# EAGLE schematic DME_Board_1 (EAGLE 7.2.0)
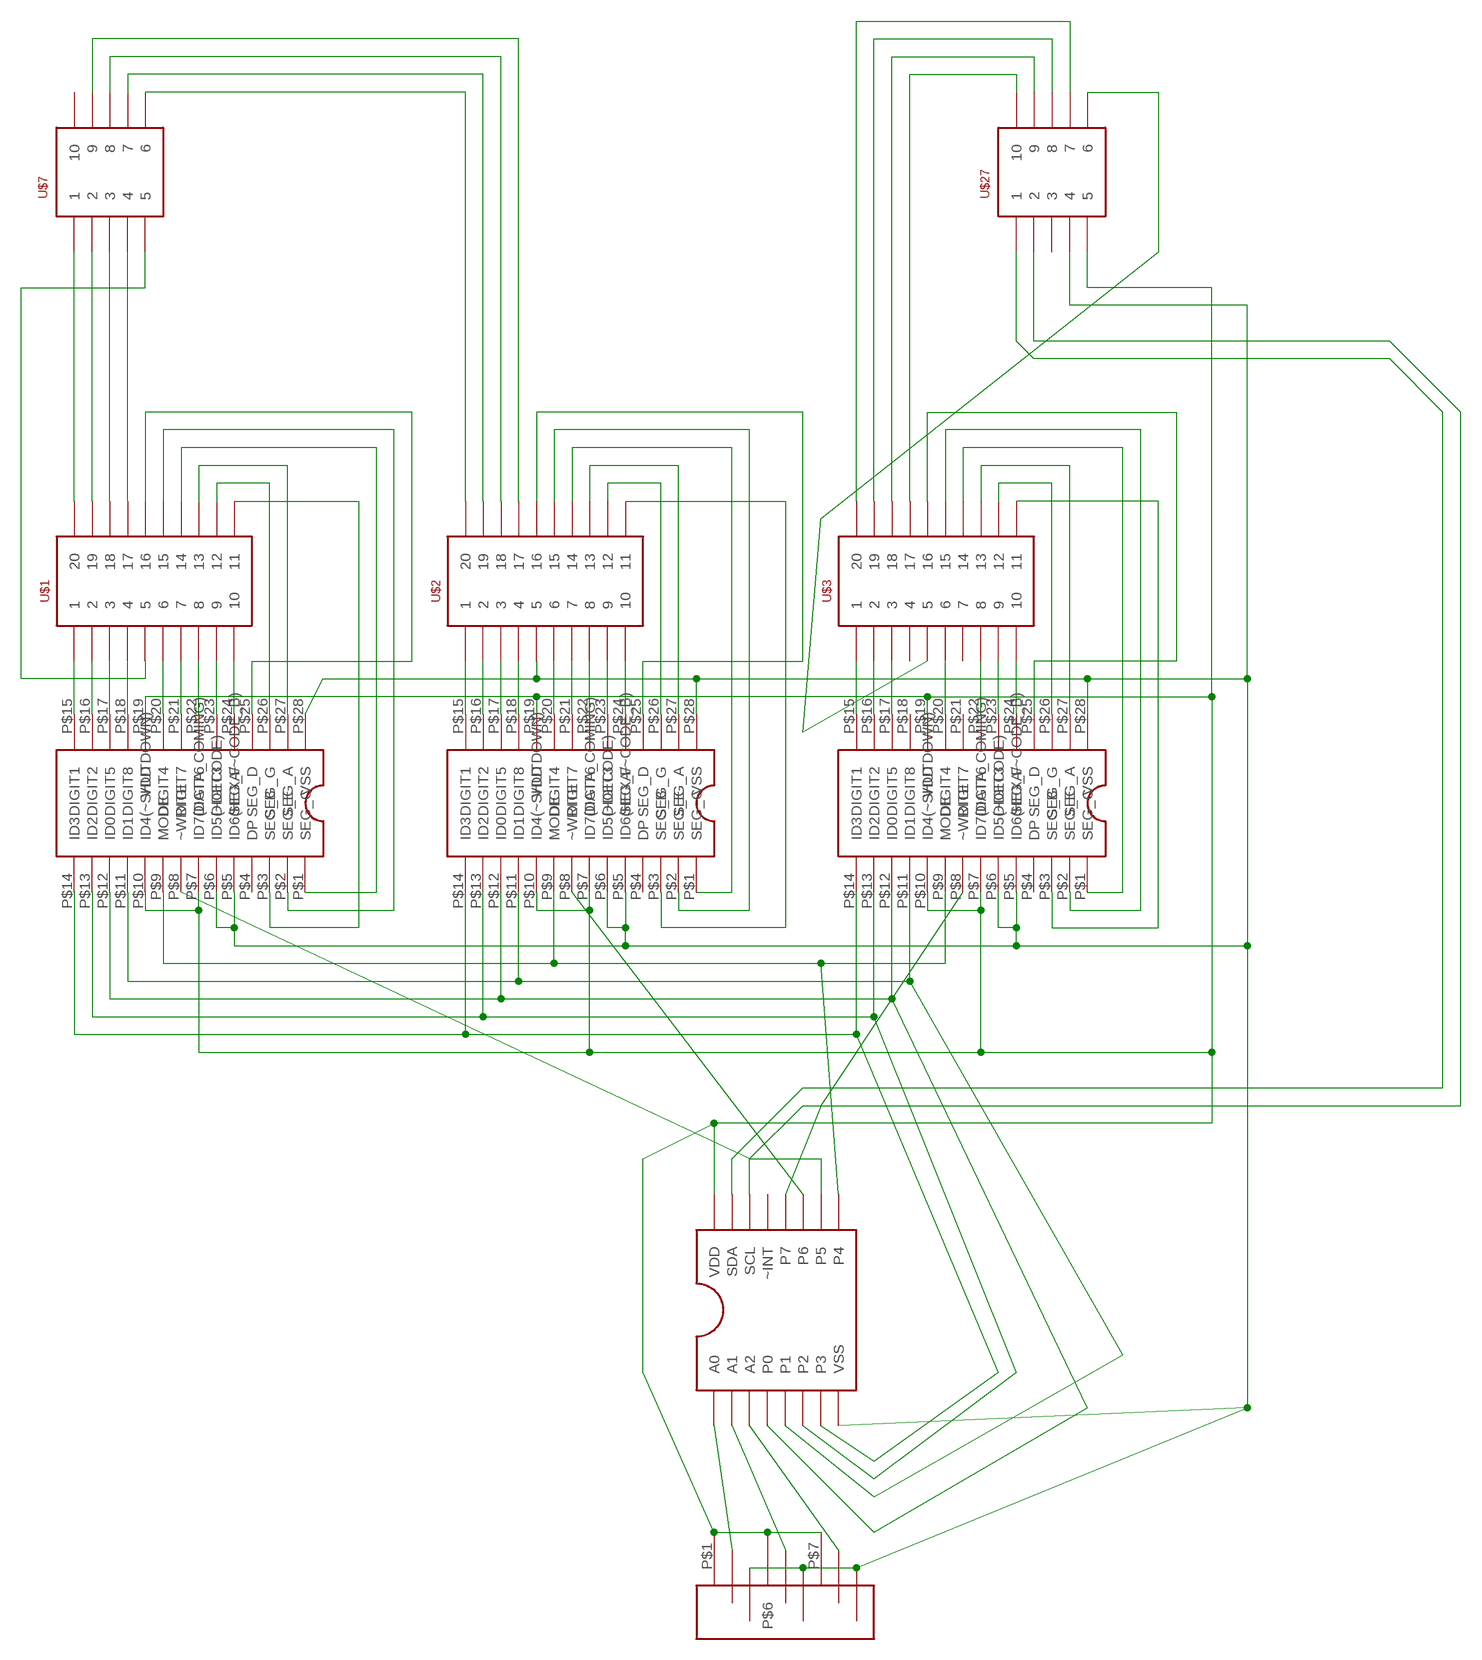
[diagram p0: schematic, sheet 1]

## Parts
U$1  LISTA_2X10  [LISTA_2X10]
U$2  LISTA_2X10  [LISTA_2X10]
U$3  LISTA_2X10  [LISTA_2X10]
U$4  ICM7228A  [ICM7228A]
U$5  ICM7228A  [ICM7228A]
U$6  ICM7228A  [ICM7228A]
U$7  LISTA_2X5  [LISTA_2X5]
U$9  PCF8574A  [PCF8574A]
U$11  ADRESA_0..2  [ADRESA_0..2]
U$27  LISTA_2X5  [LISTA_2X5]

## Nets
GND: U$2.5 U$4.P$5(ID6(HEXA/~CODE_B)) U$4.P$6(ID5(~DECODE)) U$4.P$28(VSS) U$5.P$5(ID6(HEXA/~CODE_B)) U$5.P$6(ID5(~DECODE)) U$5.P$28(VSS) U$6.P$5(ID6(HEXA/~CODE_B)) U$6.P$6(ID5(~DECODE)) U$6.P$28(VSS) U$9.VSS U$11.P$3 U$11.P$4 U$11.P$9 U$27.4
N$1: U$1.1 U$4.P$15(DIGIT1)
N$2: U$2.1 U$5.P$15(DIGIT1)
N$3: U$1.2 U$4.P$16(DIGIT2)
N$4: U$1.3 U$4.P$17(DIGIT5)
N$5: U$1.4 U$4.P$18(DIGIT8)
N$6: U$1.11 U$4.P$3(SEG_B)
N$7: U$1.6 U$4.P$20(DIGIT4)
N$8: U$1.7 U$4.P$21(DIGIT7)
N$9: U$1.8 U$4.P$22(DIGIT6)
N$10: U$1.9 U$4.P$23(DIGIT3)
N$11: U$1.10 U$4.P$24(SEG_F)
N$12: U$1.12 U$4.P$26(SEG_G)
N$13: U$1.13 U$4.P$27(SEG_A)
N$14: U$2.2 U$5.P$16(DIGIT2)
N$15: U$2.3 U$5.P$17(DIGIT5)
N$16: U$2.4 U$5.P$18(DIGIT8)
N$17: U$3.1 U$6.P$15(DIGIT1)
N$18: U$2.6 U$5.P$20(DIGIT4)
N$19: U$2.7 U$5.P$21(DIGIT7)
N$20: U$2.8 U$5.P$22(DIGIT6)
N$21: U$2.9 U$5.P$23(DIGIT3)
N$22: U$2.10 U$5.P$24(SEG_F)
N$23: U$3.2 U$6.P$16(DIGIT2)
N$24: U$3.3 U$6.P$17(DIGIT5)
N$26: U$3.6 U$6.P$20(DIGIT4)
N$28: U$3.8 U$6.P$22(DIGIT6)
N$29: U$3.9 U$6.P$23(DIGIT3)
N$30: U$3.10 U$6.P$24(SEG_F)
N$31: U$2.16 U$5.P$25(SEG_D)
N$32: U$2.12 U$5.P$26(SEG_G)
N$33: U$2.13 U$5.P$27(SEG_A)
N$34: U$3.16 U$6.P$25(SEG_D)
N$35: U$3.12 U$6.P$26(SEG_G)
N$36: U$3.13 U$6.P$27(SEG_A)
N$37: U$1.14 U$4.P$1(SEG_C)
N$38: U$1.15 U$4.P$2(SEG_E)
N$39: U$1.16 U$4.P$25(SEG_D)
N$40: U$4.P$14(ID3) U$5.P$14(ID3) U$6.P$14(ID3) U$9.P3
N$41: U$4.P$13(ID2) U$5.P$13(ID2) U$6.P$13(ID2) U$9.P2
N$42: U$4.P$12(ID0) U$5.P$12(ID0) U$6.P$12(ID0) U$9.P0
N$43: U$4.P$11(ID1) U$5.P$11(ID1) U$6.P$11(ID1) U$9.P1
N$44: U$4.P$9(MODE) U$5.P$9(MODE) U$6.P$9(MODE) U$9.P4
N$45: U$2.14 U$5.P$1(SEG_C)
N$46: U$2.15 U$5.P$2(SEG_E)
N$47: U$9.A0 U$11.P$2
N$48: U$3.14 U$6.P$1(SEG_C)
N$49: U$3.15 U$6.P$2(SEG_E)
N$50: U$9.A1 U$11.P$5
N$52: U$3.11 U$6.P$3(SEG_B)
N$53: U$2.11 U$5.P$3(SEG_B)
N$55: U$9.A2 U$11.P$8
N$60: U$6.P$8(~WRITE) U$9.P7
N$61: U$5.P$8(~WRITE) U$9.P6
N$62: U$4.P$8(~WRITE) U$9.P5
N$63: U$1.20 U$7.1
N$64: U$4.P$7(ID7(DATA_COMING)) U$4.P$10(ID4(~SHUTDOWN)) U$4.P$19(VDD) U$5.P$7(ID7(DATA_COMING)) U$5.P$10(ID4(~SHUTDOWN)) U$5.P$19(VDD) U$6.P$7(ID7(DATA_COMING)) U$6.P$10(ID4(~SHUTDOWN)) U$6.P$19(VDD) U$9.VDD U$11.P$1 U$11.P$6 U$11.P$7 U$27.5
N$65: U$1.19 U$7.2
N$66: U$1.18 U$7.3
N$67: U$1.17 U$7.4
N$68: U$1.5 U$7.5
N$69: U$2.20 U$7.6
N$70: U$2.19 U$7.7
N$71: U$2.18 U$7.8
N$72: U$2.17 U$7.9
N$73: U$9.SDA U$27.1
N$74: U$9.SCL U$27.2
N$75: U$3.17 U$27.10
N$76: U$3.18 U$27.9
N$77: U$3.5 U$27.6
N$78: U$3.19 U$27.8
N$79: U$3.20 U$27.7
Unconnected: U$3.4 U$3.7 U$4.P$4(DP) U$5.P$4(DP) U$6.P$4(DP) U$6.P$18(DIGIT8) U$6.P$21(DIGIT7) U$7.10 U$9.~INT U$27.3

## Library data of the parts
U$1-U$3 = RadioStack_v2:LISTA_2X10
U$4-U$6 = RadioStack_v2:ICM7228A
U$7 U$27 = RadioStack_v2:LISTA_2X5
U$9 = RadioStack_v2:PCF8574A
U$11 = RadioStack_v2:ADRESA_0..2